# Altium schematic sheet Parametric EQ.SchDoc
size A4
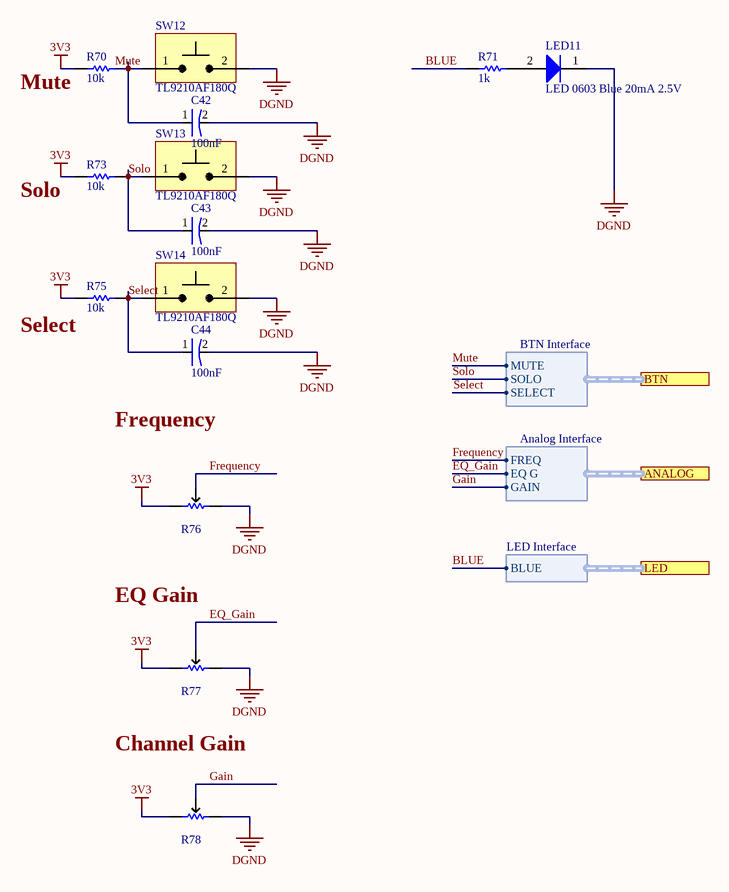
[diagram p0: Parametric EQ.SchDoc]

## Parts
C42  value 100nF  [0402-M]  (hidden comment: CAP 0.1uF CER 0402 16V X5R 10%)
C43  value 100nF  [0402-M]  (hidden comment: CAP 0.1uF CER 0402 16V X5R 10%)
C44  value 100nF  [0402-M]  (hidden comment: CAP 0.1uF CER 0402 16V X5R 10%)
LED11  LED 0603 Blue 20mA 2.5V  [VAOL-S6SB4]
R70  value 10k  [0402-M]  (hidden comment: RES 10k 0402 63mW 5%)
R71  value 1k  [0402-M]  (hidden comment: RES 1k 0402 63mW 1%)
R73  value 10k  [0402-M]  (hidden comment: RES 10k 0402 63mW 5%)
R75  value 10k  [0402-M]  (hidden comment: RES 10k 0402 63mW 5%)
R76  P120PK-Y25BR10K  [P120PK-Y25BR10K-Footprint-1]  (value not drawn)
R77  P120PK-Y25BR10K  [P120PK-Y25BR10K-Footprint-1]  (value not drawn)
R78  P120PK-Y25BR10K  [P120PK-Y25BR10K-Footprint-1]  (value not drawn)
SW12  TL9210AF180Q  [TL9210]
SW13  TL9210AF180Q  [TL9210]
SW14  TL9210AF180Q  [TL9210]

## Ports
ANALOG (harness Analog Interface), BTN (harness BTN Interface), LED (harness LED Interface)

## Harnesses
BTN Interface: MUTE, SOLO, SELECT
Analog Interface: FREQ, EQ G, GAIN
LED Interface: BLUE

## Nets
3V3: R70.1 R73.1 R75.1 R76.1 R77.1 R78.1
DGND: C42.2(Cathode) C43.2(Cathode) C44.2(Cathode) LED11.1 R76.3 R77.3 R78.3 SW12.2 SW13.2 SW14.2
BLUE: R71.1 ; port LED.BLUE
EQ_Gain: R77.2 ; port ANALOG.EQ G
Frequency: R76.2 ; port ANALOG.FREQ
Gain: R78.2 ; port ANALOG.GAIN
Mute: C42.1(Anode) R70.2 SW12.1 ; port BTN.MUTE
Select: C44.1(Anode) R75.2 SW14.1 ; port BTN.SELECT
Solo: C43.1(Anode) R73.2 SW13.1 ; port BTN.SOLO
NetLED11_2: LED11.2 R71.2

## Notes on the sheet
- (near R70) Mute
- (near R73) Solo
- (near R75) Select
- Frequency
- EQ Gain
- Channel Gain

## Library data of the parts
C42-C44 = CAP 0.1uF CER 0402 16V X5R 10%-2: CAP-0.1uF-CER-0402-16V-X5R-10%; Manufacturer: Generic; Bin: CAP1-M1; Type: SMD; Source: Capacitor Library.SchLib; Status: Active; Design Item ID: CAP 0.1uF CER 0402 16V X5R 10%; Supplier 1: Mouser; Supplier Part Number 1: 810-CGA2B2X5R1C104KA; Case/Package: 0402
LED11 = LED 0603 Blue 20mA 2.5V-1: LED-0603-Blue-20mA-2.5V-STOCK; Manufacturer: Generic; Bin: F2-DM1-4; Type: SMD; Design Item ID: LED 0603 Blue 20mA 2.5V; Supplier 1: Mouser; Supplier Part Number 1: 604-APT1608LVBCD; Status: Active; Case/Package: 0603; Source: Diode Library.SchLib
R70 R73 R75 = RES 10k 0402 63mW 5%-1: RES-10k-0402-63mW-5%; Manufacturer: Generic; Bin: F1-R7-9; MAPPING: 1(2,1,11.5k); Design Item ID: RES 10k 0402 63mW 5%; Type: SMD; Status: Active; Case/Package: 0402; Source: Resistor Library.SchLib
R71 = RES 1k 0402 63mW 1%-1: RES-1k-0402-63mW-1%; Manufacturer: Generic; Bin: F1-R3-10; MAPPING: 1(2,1,11.5k); Source: Resistor Library.SchLib; Case/Package: 0402; Type: SMD; Design Item ID: RES 1k 0402 63mW 1%; Status: Active
R76-R78 = CMP-002-00002-1: Potentiometers 12mm 10K ohm; Number of Gangs: 1; Tolerance: 20%; Max Power Dissipation: 50mW; Resistance: 10kR; Actuator Diameter: 0.236inch; Actuator Length: 0.984inch; Termination: PC Pins; Min Operating Temperature: -20°C; Max Operating Temperature: 70°C; Packaging: Tray; Power Rating: 50mW; Number of Turns: 1; Package Quantity: 275; Mount: Through Hole,Snap in; Taper: Linear; Resistor Type: Conductive Plastic,Potentiometer
SW12-SW14 = TL9210AF180Q-2: SWITCH MOM SMD SPST 50MA 12V Soft Tact; Manufacturer: E-Switch; Status: Active; Case/Package: 2 PIN; Type: SMD; Supplier 1: Mouser; Supplier Part Number 1: 612-TL9210AF180Q; Design Item ID: TL9210AF180Q; Source: Switches Library.SchLib